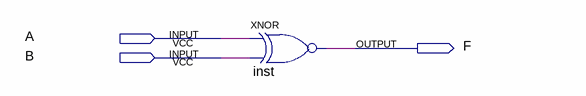
[diagram p0: schematic sheet]
// Quartus schematic xnorGate_logicgate.bdf as structural Verilog: 1 symbols, 3 pins
module xnorGate_logicgate (
  input  A,
  input  B,
  output F
);

  xnor inst (F, A, B);
endmodule
